# EAGLE design smc2 (EAGLE 9.6.2)
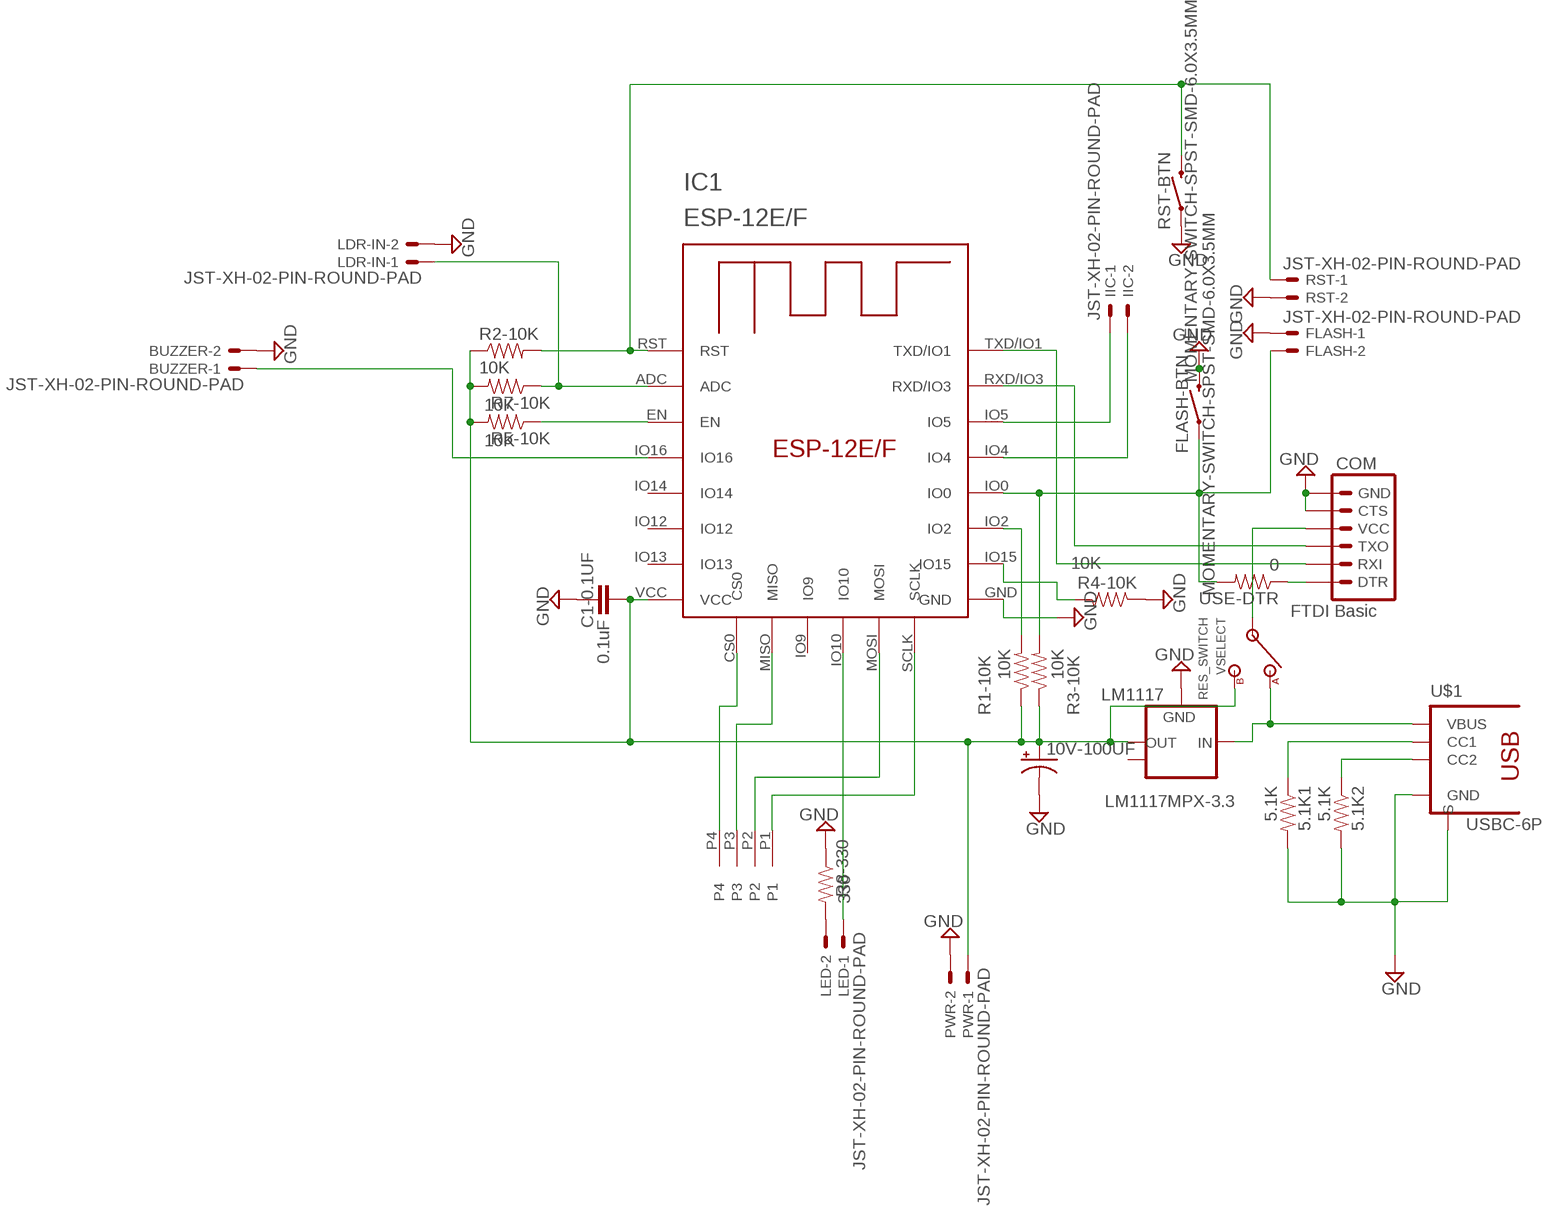
[diagram p0: schematic, sheet 1]

## Parts
5.1K1  5.1K  RESISTOR0603-RES  [0603-RES]
5.1K2  5.1K  RESISTOR0603-RES  [0603-RES]
10V-100UF  CPOL-USA/3216-18W  [A/3216-18W]
BUZZER  JST-XH-02-PIN-ROUND-PAD  [JST-XH-02-PACKAGE-ROUND-PAD]
C1-0.1UF  0.1uF  CAP0603-CAP  [0603-CAP]
COM  FTDI Basic  ARDUINO_SERIAL_PROGRAMPTH  [1X06]
FLASH  JST-XH-02-PIN-ROUND-PAD  [JST-XH-02-PACKAGE-ROUND-PAD]
FLASH-BTN  MOMENTARY-SWITCH-SPST-SMD-6.0X3.5MM  [TACTILE_SWITCH_SMD_6.0X3.5MM]
IC1  ESP-12E/F  [ESP-12E]
IIC  JST-XH-02-PIN-ROUND-PAD  [JST-XH-02-PACKAGE-ROUND-PAD]
LDR-IN  JST-XH-02-PIN-ROUND-PAD  [JST-XH-02-PACKAGE-ROUND-PAD]
LED  JST-XH-02-PIN-ROUND-PAD  [JST-XH-02-PACKAGE-ROUND-PAD]
LM1117  LM1117MPX-3.3  [SOT223]
PWR  JST-XH-02-PIN-ROUND-PAD  [JST-XH-02-PACKAGE-ROUND-PAD]
R1-10K  10K  RESISTOR0603-RES  [0603-RES]
R2-10K  10K  RESISTOR0603-RES  [0603-RES]
R3-10K  10K  RESISTOR0603-RES  [0603-RES]
R4-10K  10K  RESISTOR0603-RES  [0603-RES]
R5-10K  10K  RESISTOR0603-RES  [0603-RES]
R7-10K  10K  RESISTOR0603-RES  [0603-RES]
R8-330  330  RESISTOR0603-RES  [0603-RES]
RST  JST-XH-02-PIN-ROUND-PAD  [JST-XH-02-PACKAGE-ROUND-PAD]
RST-BTN  MOMENTARY-SWITCH-SPST-SMD-6.0X3.5MM  [TACTILE_SWITCH_SMD_6.0X3.5MM]
U$1  USBC-6P  [USCX-06FX-XXMX-01]
U$3  4PIN  [4PIN]
USE-DTR  0  RESISTOR0603-RES  [0603-RES]
VSELECT  RES_SWITCH  [RES_SWITCH]

## Nets
3V3: 10V-100UF.+ C1-0.1UF.1 IC1.VCC LM1117.2(OUT) PWR.1 R1-10K.1 R2-10K.1 R3-10K.1 R5-10K.2 R7-10K.2 VSELECT.B
5V: LM1117.3(IN) U$1.VBUS1(VBUS) U$1.VBUS2(VBUS) VSELECT.A
GND: 5.1K1.2 5.1K2.2 10V-100UF.- BUZZER.2 C1-0.1UF.2 COM.5(CTS) COM.6(GND) FLASH-BTN.2 FLASH.1 IC1.GND LDR-IN.2 LM1117.1(GND) PWR.2 R4-10K.1 R8-330.1 RST-BTN.1 RST.2 U$1.GND1(GND) U$1.GND2(GND) U$1.SHIELD1(S) U$1.SHIELD2(S) U$1.SHIELD3(S) U$1.SHIELD4(S)
IO0: FLASH-BTN.1 FLASH.2 IC1.IO0 R3-10K.2 USE-DTR.2
IO2: IC1.IO2 R1-10K.2
IO10: IC1.IO10 LED.1
N$1: IC1.IO15 R4-10K.2
N$2: IC1.EN R5-10K.1
N$3: IC1.SCLK U$3.P1
N$4: COM.4(VCC) VSELECT.C(IN)
N$5: LED.2 R8-330.2
N$6: COM.3(TXO) IC1.RXD/IO3
N$7: COM.2(RXI) IC1.TXD/IO1
N$8: COM.1(DTR) USE-DTR.1
N$9: IC1.MOSI U$3.P2
N$10: IC1.MISO U$3.P3
N$11: 5.1K2.1 U$1.CC2
N$12: 5.1K1.1 U$1.CC1
N$13: BUZZER.1 IC1.IO16
N$14: IC1.IO5 IIC.1
N$15: IC1.IO4 IIC.2
N$16: IC1.ADC LDR-IN.1 R7-10K.1
N$17: IC1.CS0 U$3.P4
RST: IC1.RST R2-10K.2 RST-BTN.2 RST.1
Unconnected: IC1.IO9 IC1.IO12 IC1.IO13 IC1.IO14 LM1117.TAB(OUT1)

## Library data of the parts
5.1K1 5.1K2 R1-10K R2-10K R3-10K R4-10K R5-10K R7-10K R8-330 USE-DTR = SparkFun:RESISTOR: Resistor Basic schematic elements and footprints for 0603, 1206, and PTH resistors.
10V-100UF = rcl:CPOL-US: POLARIZED CAPACITOR, American symbol; SPICEPREFIX: C
BUZZER FLASH IIC LDR-IN LED PWR RST = Rembrandt Electronics - JST XH Connectors v1-0:JST-XH-02-PIN: JST XH Connector 2 Pin Wire to board connector. Pitch: 2,54 mm, (0.100") Number of pins: 2 Created by Rembrandt Electronics www.rembrandtelectronics.com
C1-0.1UF = SparkFun:CAP: Capacitor Standard 0603 ceramic capacitor, and 0.1" leaded capacitor.
COM = SparkFun:ARDUINO_SERIAL_PROGRAM
FLASH-BTN RST-BTN = SparkFun-Switches:MOMENTARY-SWITCH-SPST: Momentary Switch (Pushbutton) - SPST Normally-open (NO) SPST momentary switches (buttons, pushbuttons). Variants PTH-12MM - 12mm square, through-hole Momentary Pushbutton Switch - 12mm Square <https://www.sparkfun.com/products/9190> (COM-09190) PTH-6.0MM, PTH-6.0MM-KIT - 6.0mm square, through-hole Mini Pushbutton Switch <https://www.sparkfun.com/products/97> (COM-00097) KIT package intended for soldering kit's - only one side of pads' copper is exposed. PTH-RIGHT-ANGLE-KIT - Right-angle, through-hole Right Angle Tactile Button <https://www.sparkfun.com/products/10791> - Used on SparkFun BigTime Watch Kit <https://www.sparkfun.com/products/11734> SMD-12MM - 12mm square, surface-mount Tactile Button - SMD (12mm) <https://www.sparkfun.com/products/12993> (COM-12993) Used on SparkFun PicoBoard <https://www.sparkfun.com/products/11888> SMD-4.5MM - 4.5mm Square Trackball Switch Used on SparkFun Blackberry Trackballer Breakout <https://www.sparkfun.com/products/13169> SMD-4.6MMX2.8MM - 4.60mm x 2.80mm, surface mount Used on SparkFun SAMD21 Mini Breakout <https://www.sparkfun.com/products/13664> SMD-5.2MM, SMD-5.2-REDUNDANT - 5.2mm square, surface-mount Mini Pushbutton Switch - SMD <https://www.sparkfun.com/products/8720> (COM-08720) Used on Arduino Pro Mini <https://www.sparkfun.com/products/11114> REDUNDANT package connects both switch circuits together SMD-6.0X3.5MM - 6.0 x 3.5mm, surface mount Momentary Reset Switch SMD <https://www.sparkfun.com/products/8229> (COM-08229) SMD-6.2MM-TALL - 6.2mm square, surface mount Tactile Button - SMD (6mm) <https://www.sparkfun.com/products/12992> Used on SparkFun Digital Sandbox <https://www.sparkfun.com/products/12651> SMD-RIGHT-ANGLE - Right-angle, surface mount Used on SparkFun Block for Intel® Edison - Arduino <https://www.sparkfun.com/products/13036>; PROD_ID: SWCH-00815; SF_SKU: COM-08229
IC1 = esp-12e-f:ESP-12E/F
LM1117 = lm1117:LM1117MPX-*
U$1 = USBC6P:USBC-6P: AliExpress Special! Connect 5.1k 10% resistors to each CC pin, pulled up to 3.3v or 5.0v.
U$3 = mypad:4PIN
VSELECT = switches:RES_SWITCH: 0402 Static Resistor Selector

## Board
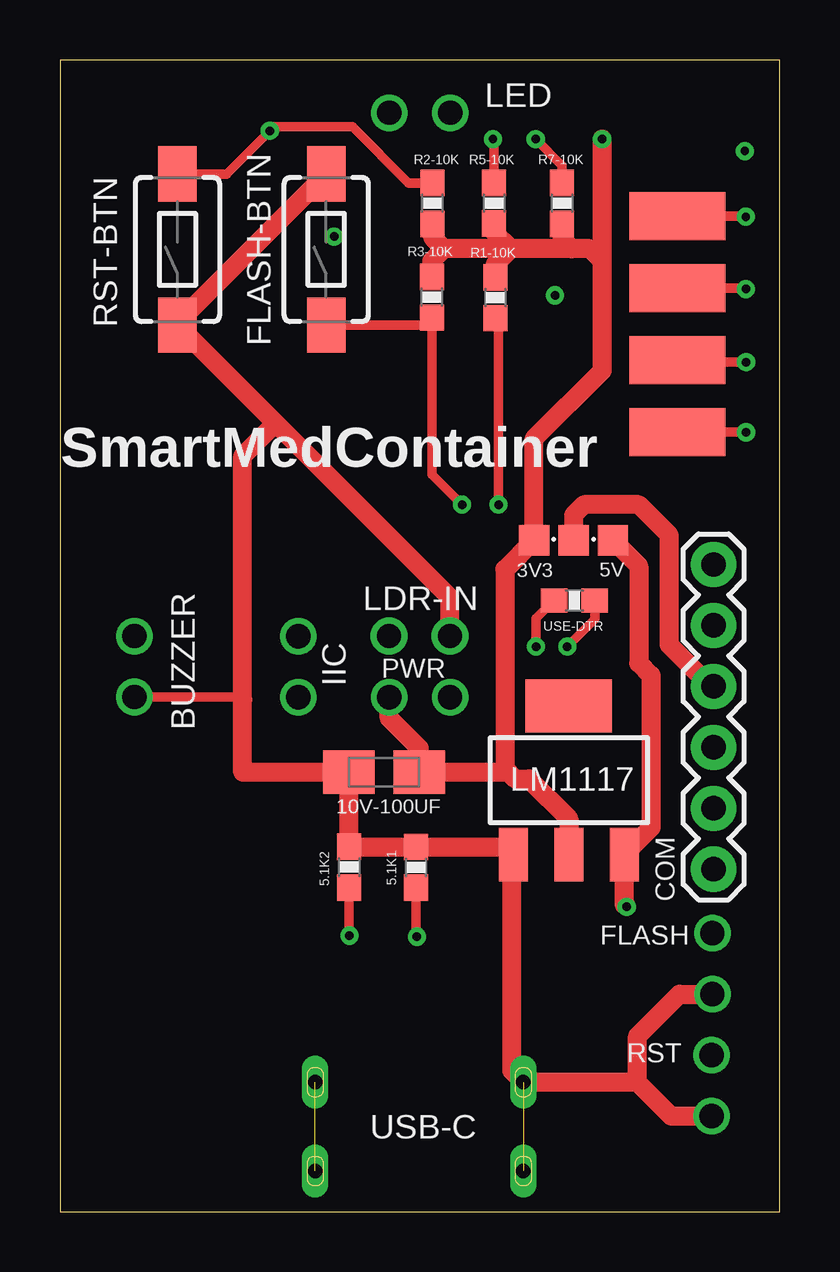
[diagram p1: board, top side]
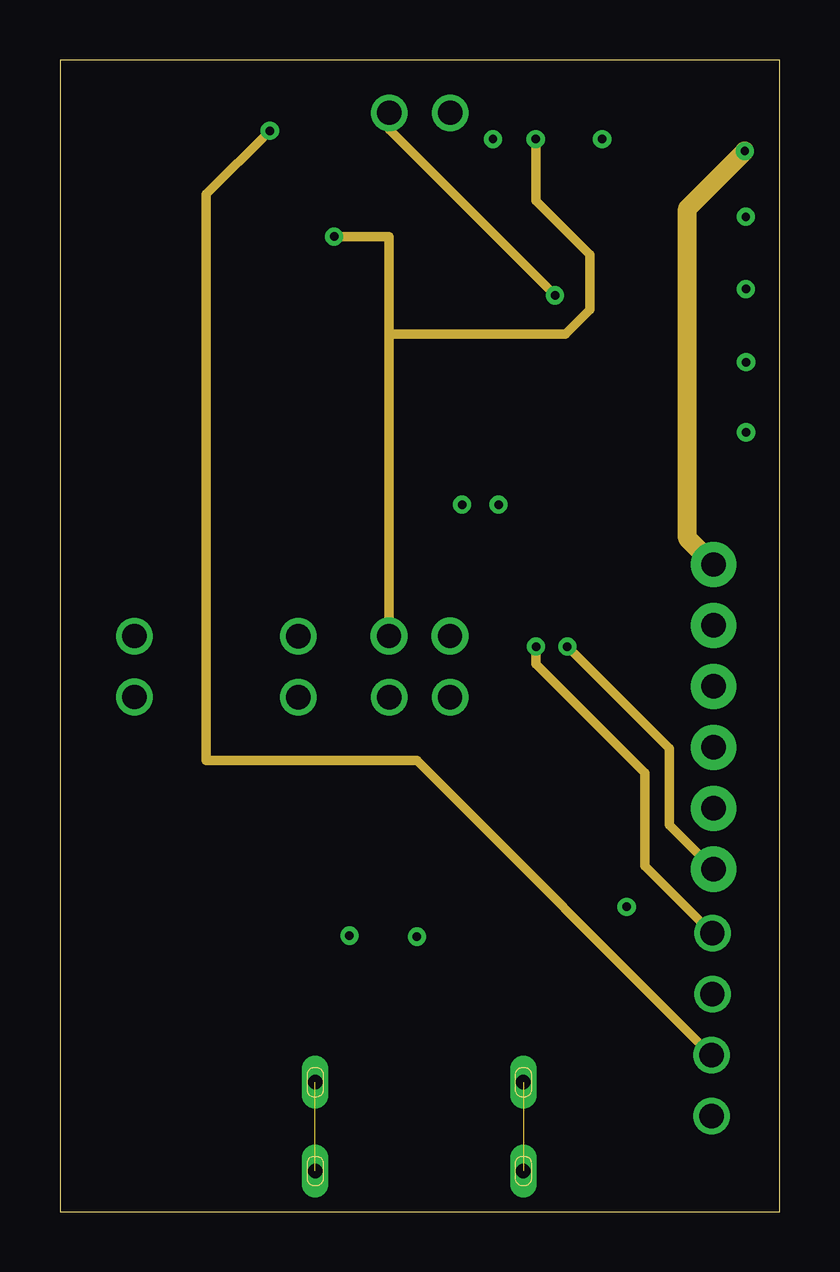
[diagram p2: board, inner layer Route2]
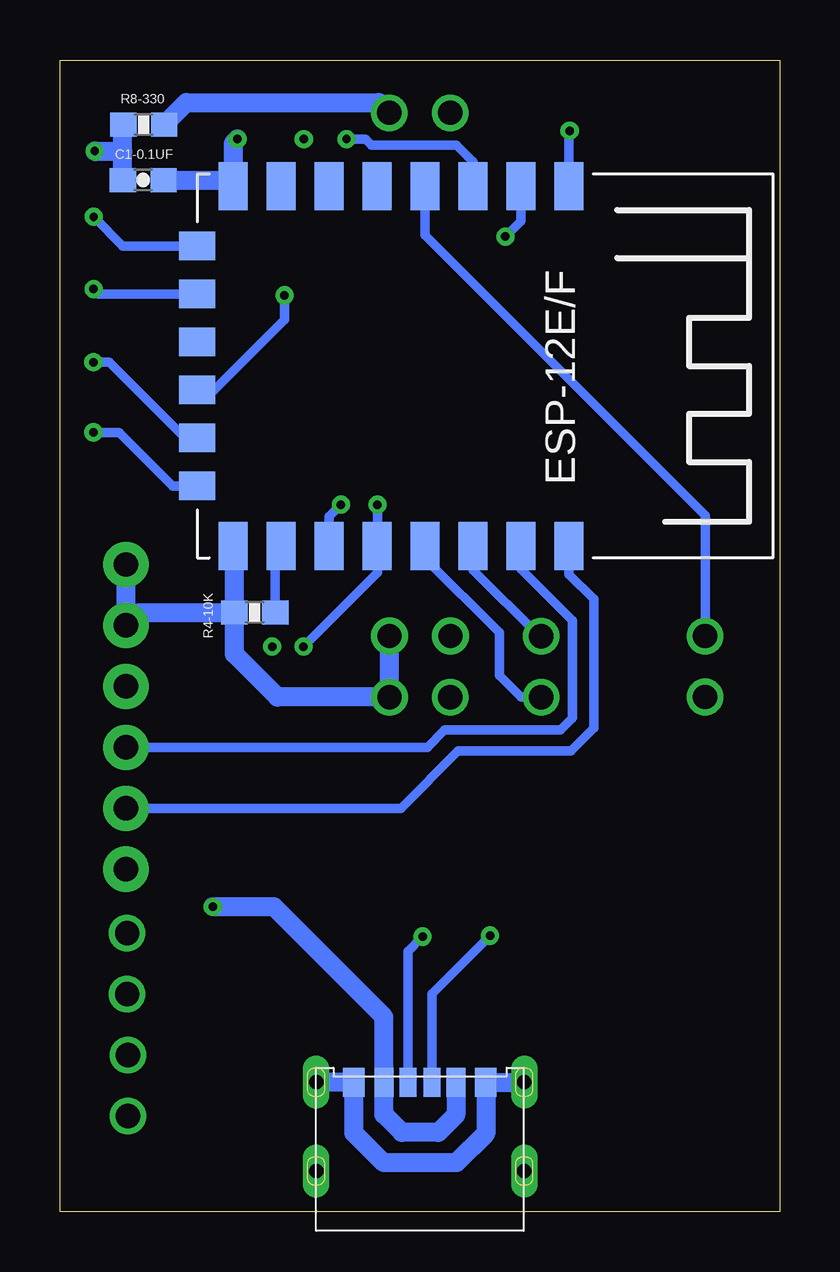
[diagram p3: board, bottom side, seen from below]

Size 30 x 48 mm. Coordinates in mm from the lower left corner, seen from the top.
Outline: 0,0 30,0 30,48 0,48 0,0
Copper layers (1+2*15+16): Top 0.035mm / dielectric 1.08mm / Route2 0.035mm / dielectric 0.15mm / Route15 0.035mm / dielectric 0.2mm / Bottom 0.035mm
Design rules "default *": minimum track width 6mil, minimum drill 0.35mm, track to track 10mil, track to pad 8mil, pad to pad 6mil, via to via 10mil, smd to smd 10mil, copper to edge 40mil, drill to drill 8mil, minimum pad ring 10mil, minimum via ring 8mil, stop-mask expansion 4mil, vias tented up to drill 0mil, thermal gap 10mil

### Footprints (pad centres in the part's own frame; a part is rotated, then mirrored left to right if it is on the bottom)
0603-RES = smd 1.1 x 1: 1 -0.85,0; 2 0.85,0
A/3216-18W = smd 2.15 x 1.8: + 1.475,0; - -1.475,0
JST-XH-02-PACKAGE-ROUND-PAD = drill 1.016: 1 -1.27,0; 2 1.27,0
0603-CAP = smd 1.1 x 1: 1 -0.85,0; 2 0.85,0
1X06 = drill 1.016 pad 1.88: 1 0,0; 2 2.54,0; 3 5.08,0; 4 7.62,0; 5 10.16,0; 6 12.7,0
TACTILE_SWITCH_SMD_6.0X3.5MM = smd 2.3 x 1.6: 1 -3.15,0; 2 3.15,0
ESP-12E = smd 2 x 1.2: ADC -7.46,5.53; EN -7.46,3.53; GND 7.54,-6.47; IO0 7.54,-0.47; IO2 7.54,-2.47; IO4 7.54,1.53; IO5 7.54,3.53; IO12 -7.46,-2.47; IO13 -7.46,-4.47; IO14 -7.46,-0.47; IO15 7.54,-4.47; IO16 -7.46,1.53; RST -7.46,7.53; RXD/IO3 7.54,5.53; TXD/IO1 7.54,7.53; VCC -7.46,-6.47 | smd 1.2 x 1.5: CS0 -4.96,-7.97; IO9 -0.96,-7.97; IO10 1.04,-7.97; MISO -2.96,-7.97; MOSI 3.04,-7.97; SCLK 5.04,-7.97
SOT223 = smd 1.219 x 2.235: 1 -2.311,-3.099; 2 0,-3.099; 3 2.311,-3.099 | smd 3.6 x 2.2: TAB 0,3.099
USCX-06FX-XXMX-01 = smd 0.7 x 1.2: CC1 0.5,-1.75; CC2 -0.5,-1.75 | smd 0.9 x 1.2: GND1 2.75,-1.75; GND2 -2.75,-1.75 | drill 0.6 long: SHIELD1 4.325,1.95; SHIELD2 4.325,-1.75; SHIELD3 -4.35,-1.75; SHIELD4 -4.35,1.95 | smd 0.8 x 1.2: VBUS1 1.5,-1.75; VBUS2 -1.5,-1.75
4PIN = smd 4 x 2: P1 0,4.5; P2 0,1.5; P3 0,-1.5; P4 0,-4.5
RES_SWITCH = smd 1.27 x 1.27: A -1.642,0; B 1.642,0; C 0,0

### Placement (x,y rotation side)
5.1K1  14.85,14.35 90 top
5.1K2  12.06,14.36 90 top
10V-100UF  13.51,18.31 0 top
BUZZER  3.1,22.72 270 top
C1-0.1UF  26.53,43 180 bottom
COM  27.25,14.27 90 top
FLASH  27.2,10.33 90 top
FLASH-BTN  11.1,40.1 90 top
IC1  16.31,35.29 270 bottom
IIC  9.94,22.71 270 top
LDR-IN  14.99,23.99 0 top
LED  15,45.8 0 top
LM1117  21.22,17.98 0 top
PWR  14.99,21.44 0 top
R1-10K  18.15,38.09 270 top
R2-10K  15.53,42.02 90 top
R3-10K  15.5,38.11 270 top
R4-10K  21.88,24.97 0 bottom
R5-10K  18.1,42.03 270 top
R7-10K  20.94,42.02 270 top
R8-330  26.51,45.3 0 bottom
RST  27.17,5.25 270 top
RST-BTN  4.9,40.1 90 top
U$1  14.99,3.64 180 bottom
U$3  25.75,36.98 180 top
USE-DTR  21.45,25.48 180 top
VSELECT  21.41,27.99 180 top

### Tracks (layer width: path | path; a pad name or v marks a point on that pad's centre or on a via)
3V3  (via drill 0.35)
  Top 0.8: 18.7,18.31 10V-100UF.+ 14.98,19.3 13.72,20.57 PWR.1 | 22.61,39.62 22.61,35.05 19.77,32.21 VSELECT.B 18.54,26.76 18.54,18.47 18.7,18.31 | 22.61,39.62 22.1,40.13 21.34,40.13 | 21.34,40.13 18.8,40.13 | 18.8,40.13 16,40.13 | 16,40.13 15.53,40.6 R2-10K.1 | R3-10K.1 15.5,39.63 16,40.13 | R1-10K.1 18.15,39.49 18.8,40.13 | R5-10K.2 18.1,40.83 18.8,40.13 | 22.61,39.62 v22.61,44.7 | 18.7,18.31 18.98,18.03 19.56,18.03 21.22,16.38 LM1117.2 | R7-10K.2 20.93,40.53 21.34,40.13
  Bottom 0.8: v22.61,44.7 22.78,44.53 IC1.VCC 23.03,43 C1-0.1UF.1
5V  (via drill 0.35)
  Top 0.8: VSELECT.A 24.13,26.91 24.13,22.86 24.64,22.35 24.64,15.99 LM1117.3 23.53,12.79 v23.62,12.7
  Bottom 0.8: U$1.VBUS2 13.49,4.03 14.22,3.3 15.75,3.3 16.5,4.05 U$1.VBUS1 16.5,8.11 21.08,12.7 v23.62,12.7
GND  (via drill 0.35)  (2 unrouted)
  Top 0.4: BUZZER.2 7.51,21.45 7.62,21.34
  Top 0.8: 12.04,17.68 10V-100UF.- | FLASH-BTN.2 4.9,37.05 RST-BTN.1 8.99,32.86 | LDR-IN.2 16.26,25.59 8.99,32.86 | 10V-100UF.- 7.62,18.31 7.62,21.34 7.62,31.5 8.99,32.86 | 10V-100UF.- 12.13,18.21 | 5.1K1.2 | 18.84,14.95 LM1117.1 | 18.84,14.95 18.84,5.87 U$1.SHIELD2 24.07,5.39 | RST.2 25.49,3.98 24.07,5.39 | 24.07,5.39 24.07,7.31 25.82,9.06 FLASH.1 | 10V-100UF.- 12.04,15.23 5.1K2.2 5.1K1.2 | 5.1K1.2 18.59,15.2 18.84,14.95
  Route2 0.8: COM.6 26.16,28.06 26.16,41.81 v28.55,44.2
  Bottom 0.8: R4-10K.1 22.73,27.7 IC1.GND | R4-10K.1 26.71,24.97 COM.5 COM.6 | R4-10K.1 22.73,23.23 20.93,21.44 PWR.2 LDR-IN.2 | U$1.SHIELD2 U$1.GND1 17.75,3.27 16.51,2.03 13.46,2.03 12.24,3.25 U$1.GND2 U$1.SHIELD3 | C1-0.1UF.2 27.38,44.2 | 27.38,44.2 27.38,45.28 R8-330.1 | v28.55,44.2 27.38,44.2
IO0  (via drill 0.35)
  Top 0.4: FLASH-BTN.1 15.19,36.95 R3-10K.2 15.5,30.73 v16.76,29.46 | USE-DTR.2 19.85,24.73 v19.85,23.55
  Route2 0.4: FLASH.2 24.38,14.42 24.38,18.29 19.85,22.82 v19.85,23.55
  Bottom 0.4: v16.76,29.46 16.76,27.77 | 16.76,27.77 IC1.IO0 | v19.85,23.55 16.76,26.64 16.76,27.77
IO2  (via drill 0.35)
  Top 0.4: v18.29,29.46 18.29,37.1 R1-10K.2
  Bottom 0.4: IC1.IO2 18.78,28.97 v18.29,29.46
IO10  (via drill 0.35)
  Route2 0.4: v20.64,38.19 13.73,45.1 LED.1
  Bottom 0.4: IC1.IO10 23.57,34.25 20.64,37.17 v20.64,38.19
N$1
  Bottom 0.4: R4-10K.2 21.03,27.5 IC1.IO15
N$2  (via drill 0.35)
  Top 0.4: R5-10K.1 18.1,44.65 v18.05,44.7
  Bottom 0.4: v18.05,44.7 17.27,44.7 17.02,44.45 13.46,44.45 12.78,43.77 IC1.EN
N$3  (via drill 0.35)
  Top 0.4: U$3.P1 v28.6,32.48
  Bottom 0.4: v28.6,32.48 27.52,32.48 25.3,30.25 IC1.SCLK
N$4
  Top 0.8: COM.4 27.13,21.89 25.4,23.62 25.4,28.19 24.13,29.46 21.84,29.46 21.41,29.03 VSELECT.C
N$5
  Bottom 0.8: R8-330.2 24.73,46.23 16.7,46.23 LED.2
N$6
  Bottom 0.4: COM.3 14.69,19.35 13.97,20.07 9.14,20.07 8.64,20.57 8.64,24.64 10.78,26.78 IC1.RXD/IO3
N$7
  Bottom 0.4: IC1.TXD/IO1 8.78,26.56 7.75,25.53 7.75,20.15 8.7,19.2 13.4,19.2 15.79,16.81 COM.2
N$8  (via drill 0.35)
  Top 0.4: USE-DTR.1 22.3,24.7 v21.15,23.55
  Route2 0.4: v21.15,23.55 25.4,19.3 25.4,16.12 COM.1
N$9  (via drill 0.35)
  Top 0.4: U$3.P2 25.83,35.4 v28.6,35.4
  Bottom 0.4: IC1.MOSI 24.79,32.25 27.94,35.4 v28.6,35.4
N$10  (via drill 0.35)
  Top 0.4: v28.6,38.45 28.57,38.48 U$3.P3
  Bottom 0.4: v28.6,38.45 28.4,38.25 IC1.MISO
N$11  (via drill 0.35)
  Top 0.4: 5.1K2.1 v12.06,11.51 v12.07,11.5
  Bottom 0.4: v12.07,11.5 14.49,9.07 U$1.CC2
N$12  (via drill 0.35)
  Top 0.4: v14.88,11.46 14.85,11.49 5.1K1.1
  Bottom 0.4: U$1.CC1 15.49,10.85 v14.88,11.46
N$13
  Bottom 0.4: BUZZER.1 3.1,29.01 14.78,40.69 IC1.IO16
N$14
  Bottom 0.4: IC1.IO5 12.78,26.75 10.01,23.98 IIC.1
N$15
  Bottom 0.4: IC1.IO4 14.78,27.23 11.68,24.13 11.68,22.35 10.77,21.44 IIC.2
N$16  (via drill 0.35)
  Top 0.4: R7-10K.1 20.93,43.6 v19.83,44.7
  Route2 0.4: v11.43,40.64 13.72,40.64 13.72,36.58 | LDR-IN.1 13.72,36.58 | v19.83,44.7 19.83,42.14 22.1,39.88 22.1,37.59 21.08,36.58 13.72,36.58
  Bottom 0.4: v11.43,40.64 10.78,41.29 IC1.ADC
N$17  (via drill 0.35)
  Top 0.4: U$3.P4 28.57,41.48 v28.59,41.46
  Bottom 0.4: v28.59,41.46 27.38,40.25 IC1.CS0
RST  (via drill 0.35)
  Top 0.4: RST-BTN.2 6.95,43.25 v8.75,45.05 8.91,45.21 12.19,45.21 14.53,42.87 R2-10K.2
  Route2 0.4: RST.1 14.89,18.8 6.1,18.8 6.1,42.4 v8.75,45.05
  Bottom 0.4: IC1.RST 8.78,45.02 v8.75,45.05

### Text on the board
tNames: SmartMedContainer | USB-C